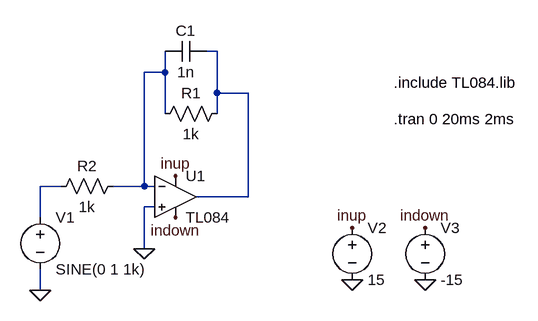
[diagram p0: schematic 07-Integ.asc]
07-Integ.asc, the LTspice schematic file:
Version 4
SHEET 1 880 680
WIRE 400 -96 384 -96
WIRE 320 -64 320 -96
WIRE 320 -64 288 -64
WIRE 400 -32 400 -96
WIRE 448 -32 400 -32
WIRE 320 0 320 -64
WIRE 400 0 400 -32
WIRE 160 112 128 112
WIRE 288 112 288 -64
WIRE 288 112 240 112
WIRE 304 112 288 112
WIRE 448 128 448 -32
WIRE 448 128 368 128
WIRE 304 144 288 144
WIRE 128 160 128 112
WIRE 288 208 288 144
WIRE 128 272 128 240
FLAG 288 208 0
FLAG 128 272 0
FLAG 608 256 0
FLAG 720 256 0
FLAG 608 176 inup
FLAG 336 96 inup
FLAG 720 176 indown
FLAG 336 160 indown
SYMBOL voltage 128 144 R0
WINDOW 123 0 0 Left 0
WINDOW 39 0 0 Left 0
SYMATTR InstName V1
SYMATTR Value SINE(0 1 1k)
SYMBOL Opamps\\opamp2 336 64 R0
SYMATTR InstName U1
SYMATTR Value TL084
SYMBOL res 416 -16 R90
WINDOW 0 0 56 VBottom 2
WINDOW 3 32 56 VTop 2
SYMATTR InstName R1
SYMATTR Value 1k
SYMBOL cap 384 -112 R90
WINDOW 0 0 32 VBottom 2
WINDOW 3 32 32 VTop 2
SYMATTR InstName C1
SYMATTR Value 1n
SYMBOL res 256 96 R90
WINDOW 0 0 56 VBottom 2
WINDOW 3 32 56 VTop 2
SYMATTR InstName R2
SYMATTR Value 1k
SYMBOL voltage 608 160 R0
WINDOW 123 0 0 Left 0
WINDOW 39 0 0 Left 0
SYMATTR InstName V2
SYMATTR Value 15
SYMBOL voltage 720 160 R0
WINDOW 123 0 0 Left 0
WINDOW 39 0 0 Left 0
SYMATTR InstName V3
SYMATTR Value -15
TEXT 672 -48 Left 2 !.include TL084.lib
TEXT 672 8 Left 2 !.tran 0 20ms 2ms

The netlist it stands for:
* 07-Integ.asc
V1 N003 0 SINE(0 1 1k)
XU1 0 N002 inup indown N001 TL084  ; pins In+ In- V+ V- OUT
R1 N001 N002 1k
C1 N001 N002 1n
R2 N002 N003 1k
V2 inup 0 15
V3 indown 0 -15
.include TL084.lib
.tran 0 20ms 2ms
.backanno
.end